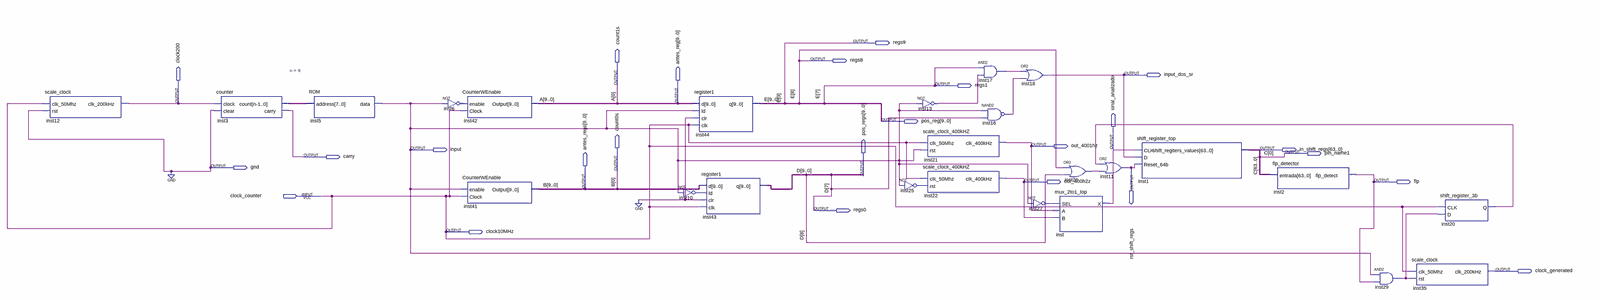
[diagram p0: schematic sheet, whole]
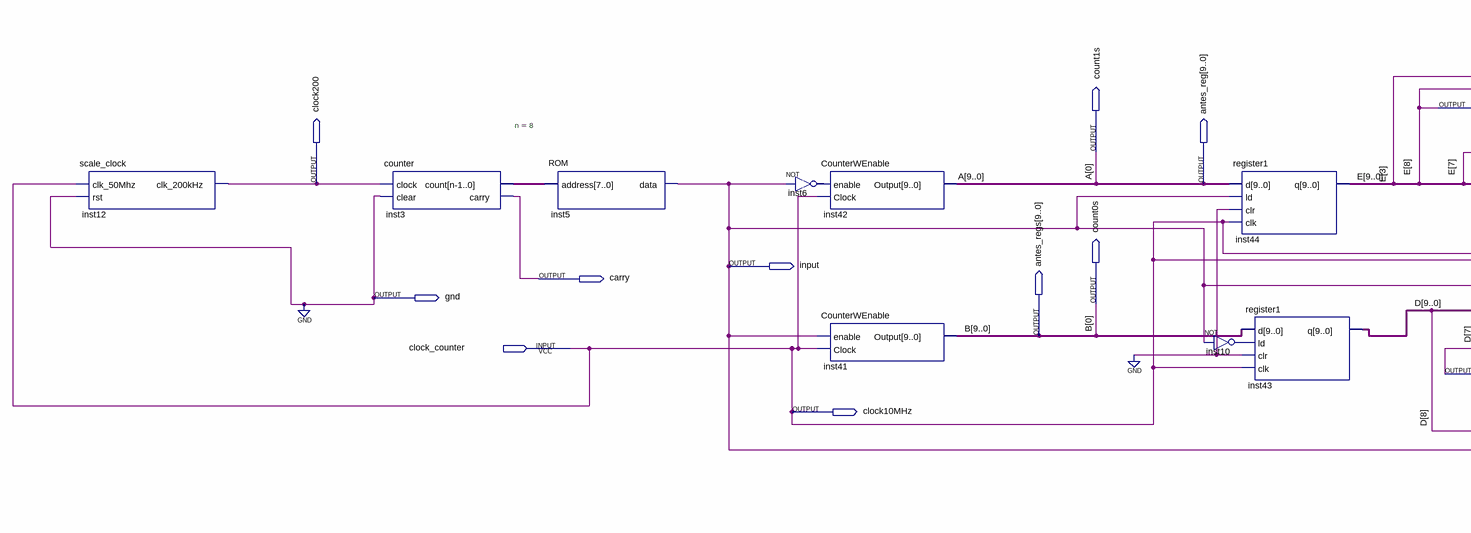
[diagram p1: schematic sheet, left part]
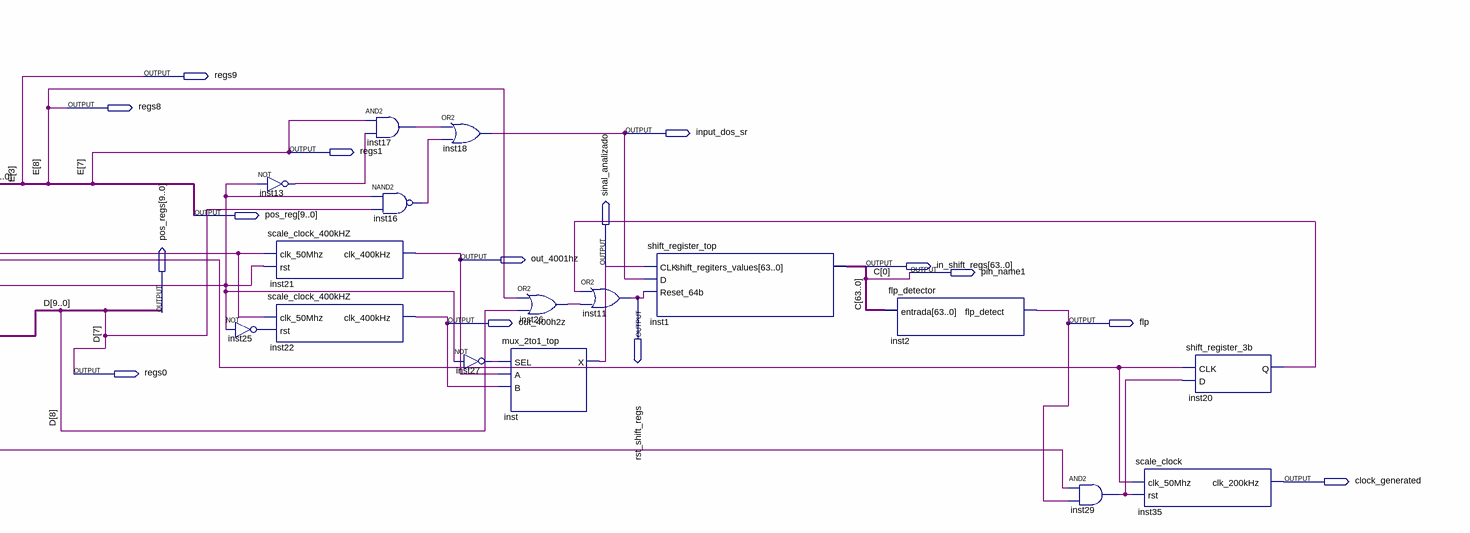
[diagram p2: schematic sheet, right part]
// Quartus schematic synchro.bdf as structural Verilog: 25 symbols, 25 pins
module synchro (
  input  clock_counter,
  output regs9,
  output regs8,
  output input_dos_sr,
  output count1s,
  output regs1,
  output clock200,
  output [9:0] antes_reg,
  output [9:0] pos_reg,
  output out_4001hz,
  output \input ,
  output sinal_analizado,
  output [63:0] in_shift_regs,
  output pin_name1,
  output carry,
  output gnd,
  output rst_shift_regs,
  output count0s,
  output [9:0] pos_regs,
  output out_400h2z,
  output flp,
  output [9:0] antes_regs,
  output regs0,
  output clock10MHz,
  output clock_generated
);

  wire inst6_out, inst10_out, inst13_out, inst16_out, inst17_out, inst20_q, inst25_out, inst26_out,
       inst27_out, inst29_out;
  wire [7:0] inst3_count;

  scale_clock inst12 (.clk_50Mhz(clock_counter), .rst(1'b0), .clk_200kHz(clock200));
  counter #(.n(8)) inst3 (.clock(clock200), .clear(1'b0), .count(inst3_count), .carry(carry));
  ROM inst5 (.address(inst3_count), .data(\input ));
  not inst6 (inst6_out, \input );
  CounterWEnable inst42 (.enable(inst6_out), .Clock(clock_counter), .Output(antes_reg));
  CounterWEnable inst41 (.enable(\input ), .Clock(clock_counter), .Output(antes_regs));
  register1 inst44 (.d(antes_reg), .ld(\input ), .clr(1'b0), .clk(clock_counter), .q(pos_reg));
  register1 inst43 (.d(antes_regs), .ld(inst10_out), .clr(1'b0), .clk(clock_counter), .q(pos_regs));
  not inst10 (inst10_out, \input );
  not inst25 (inst25_out, \input );
  not inst13 (inst13_out, \input );
  scale_clock_400kHZ inst21 (.clk_50Mhz(clock_counter), .rst(\input ), .clk_400kHz(out_4001hz));
  scale_clock_400kHZ inst22 (.clk_50Mhz(clock_counter), .rst(inst25_out), .clk_400kHz(out_400h2z));
  and inst17 (inst17_out, pos_reg[7], inst13_out);
  nand inst16 (inst16_out, \input , pos_regs[7]);
  or inst18 (input_dos_sr, inst17_out, inst16_out);
  not inst27 (inst27_out, \input );
  or inst26 (inst26_out, pos_reg[8], pos_regs[8]);
  mux_2to1_top inst (.SEL(inst27_out), .A(out_4001hz), .B(out_400h2z), .X(sinal_analizado));
  or inst11 (rst_shift_regs, inst20_q, inst26_out);
  shift_register_top inst1 (
    .CLK(sinal_analizado), .D(input_dos_sr), .Reset_64b(rst_shift_regs), .shift_regiters_values(in_shift_regs));
  flp_detector inst2 (.entrada(in_shift_regs), .flp_detect(flp));
  and inst29 (inst29_out, \input , flp);
  scale_clock inst35 (.clk_50Mhz(clock_counter), .rst(inst29_out), .clk_200kHz(clock_generated));
  shift_register_3b inst20 (.CLK(clock_counter), .D(inst29_out), .Q(inst20_q));

  assign clock10MHz = clock_counter;
  assign count0s = antes_regs[0];
  assign count1s = antes_reg[0];
  assign gnd = 1'b0;
  assign pin_name1 = in_shift_regs[0];
  assign regs0 = pos_regs[7];
  assign regs1 = pos_reg[7];
  assign regs8 = pos_reg[8];
  assign regs9 = pos_reg[3];

  // Other names for the same wires on the sheet: A[9:0] = antes_reg; B[9:0] = antes_regs; E[9:0] = pos_reg;
  //   C[63:0] = in_shift_regs; D[9:0] = pos_regs
endmodule
